# EAGLE design quadlighter (EAGLE 5.07)
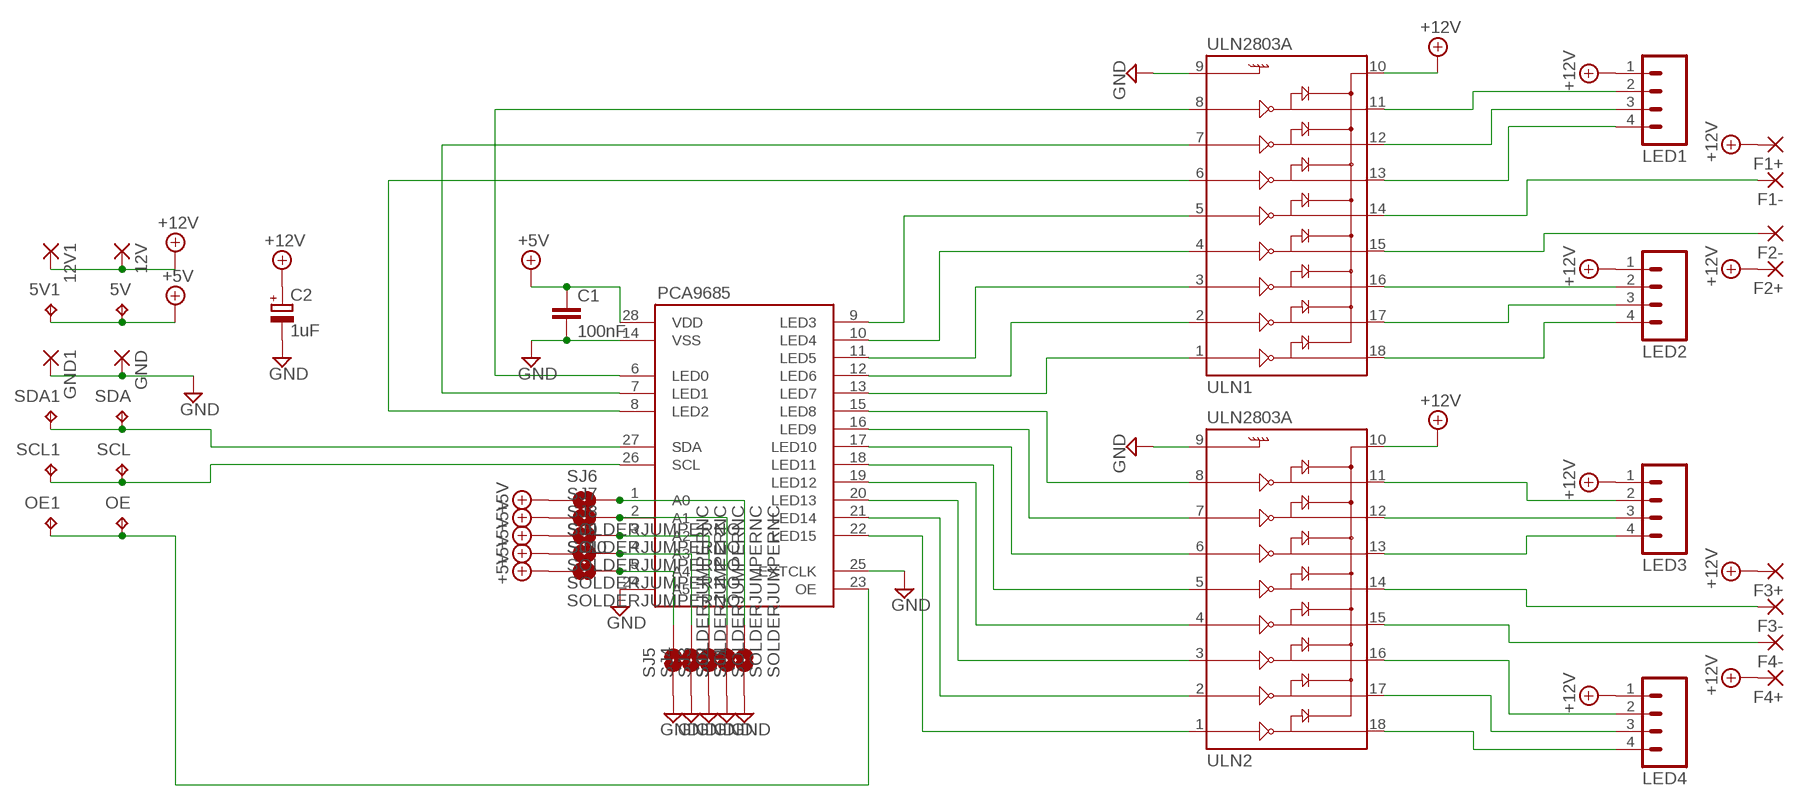
[diagram p0: schematic, sheet 1]

## Parts
5V  TPPAD1-13  [P1-13]
5V1  TPPAD1-13  [P1-13]
12V  2,54/1,1  [2,54/1,1]
12V1  2,54/1,1  [2,54/1,1]
C1  100nF  C-EUC1206  [C1206]
C2  1uF  CPOL-EUSMCB  [SMC_B]
F1+  2,54/1,1  [2,54/1,1]
F1-  2,54/1,1  [2,54/1,1]
F2+  2,54/1,1  [2,54/1,1]
F2-  2,54/1,1  [2,54/1,1]
F3+  2,54/1,1  [2,54/1,1]
F3-  2,54/1,1  [2,54/1,1]
F4+  2,54/1,1  [2,54/1,1]
F4-  2,54/1,1  [2,54/1,1]
GND  2,54/1,1  [2,54/1,1]
GND1  2,54/1,1  [2,54/1,1]
LED1  M04LONGPADS  [1X04_LONGPADS]
LED2  M04LONGPADS  [1X04_LONGPADS]
LED3  M04LONGPADS  [1X04_LONGPADS]
LED4  M04LONGPADS  [1X04_LONGPADS]
OE  TPPAD1-13  [P1-13]
OE1  TPPAD1-13  [P1-13]
PCA9685  PCA9685  [TSSOP28]
SCL  TPPAD1-13  [P1-13]
SCL1  TPPAD1-13  [P1-13]
SDA  TPPAD1-13  [P1-13]
SDA1  TPPAD1-13  [P1-13]
SJ1  SOLDERJUMPERNC  [SJ_2S]
SJ2  SOLDERJUMPERNC  [SJ_2S]
SJ3  SOLDERJUMPERNC  [SJ_2S]
SJ4  SOLDERJUMPERNC  [SJ_2S]
SJ5  SOLDERJUMPERNC  [SJ_2S]
SJ6  SOLDERJUMPERNO  [SJ_2S-NO]
SJ7  SOLDERJUMPERNO  [SJ_2S-NO]
SJ8  SOLDERJUMPERNO  [SJ_2S-NO]
SJ9  SOLDERJUMPERNO  [SJ_2S-NO]
SJ10  SOLDERJUMPERNO  [SJ_2S-NO]
ULN1  ULN2803A  ULN2803SOIC  [SO018]
ULN2  ULN2803A  ULN2803SOIC  [SO018]

## Nets
+5V: 5V1.TP 5V.TP C1.1 PCA9685.28(VDD) SJ6.1 SJ7.1 SJ8.1 SJ9.1 SJ10.1
+12V: 12V1.1(P) 12V.1(P) C2.+ F1+.1(P) F2+.1(P) F3+.1(P) F4+.1(P) LED1.1 LED2.1 LED3.1 LED4.1 ULN1.10 ULN2.10
GND: C1.2 C2.- GND1.1(P) GND.1(P) PCA9685.14(VSS) PCA9685.24(A5) PCA9685.25(EXTCLK) SJ1.1 SJ2.1 SJ3.1 SJ4.1 SJ5.1 ULN1.9 ULN2.9
N$1: PCA9685.6(LED0) ULN1.8
N$2: PCA9685.7(LED1) ULN1.7
N$3: PCA9685.8(LED2) ULN1.6
N$4: PCA9685.9(LED3) ULN1.5
N$5: PCA9685.10(LED4) ULN1.4
N$6: PCA9685.11(LED5) ULN1.3
N$7: PCA9685.12(LED6) ULN1.2
N$8: PCA9685.13(LED7) ULN1.1
N$9: PCA9685.27(SDA) SDA1.TP SDA.TP
N$10: PCA9685.26(SCL) SCL1.TP SCL.TP
N$11: OE1.TP OE.TP PCA9685.23(OE)
N$12: PCA9685.15(LED8) ULN2.8
N$13: PCA9685.16(LED9) ULN2.7
N$14: PCA9685.17(LED10) ULN2.6
N$15: PCA9685.18(LED11) ULN2.5
N$16: PCA9685.19(LED12) ULN2.4
N$17: PCA9685.20(LED13) ULN2.3
N$18: PCA9685.21(LED14) ULN2.2
N$19: PCA9685.22(LED15) ULN2.1
N$20: LED1.2 ULN1.11
N$21: F2-.1(P) ULN1.15
N$22: LED1.3 ULN1.12
N$23: LED1.4 ULN1.13
N$24: F1-.1(P) ULN1.14
N$25: PCA9685.1(A0) SJ1.2 SJ6.2
N$26: PCA9685.2(A1) SJ2.2 SJ7.2
N$27: PCA9685.3(A2) SJ3.2 SJ8.2
N$28: PCA9685.4(A3) SJ4.2 SJ9.2
N$29: PCA9685.5(A4) SJ5.2 SJ10.2
N$30: LED2.2 ULN1.16
N$31: LED3.3 ULN2.12
N$32: LED2.3 ULN1.17
N$33: LED3.2 ULN2.11
N$34: LED2.4 ULN1.18
N$35: LED3.4 ULN2.13
N$36: F3-.1(P) ULN2.14
N$37: LED4.2 ULN2.16
N$38: LED4.3 ULN2.17
N$39: LED4.4 ULN2.18
N$40: F4-.1(P) ULN2.15

## Library data of the parts
5V 5V1 OE OE1 SCL SCL1 SDA SDA1 = testpad:TP: Test pad
12V 12V1 F1+ F1- F2+ F2- F3+ F3- F4+ F4- GND GND1 = wirepad:2,54/1,1: THROUGH-HOLE PAD
C1 = rcl:C-EU: CAPACITOR, European symbol
C2 = rcl:CPOL-EU: POLARIZED CAPACITOR, European symbol
LED1-LED4 = SparkFun:M04: Header 4 Standard 4-pin 0.1" header. Use with straight break away headers (SKU : PRT-00116), right angle break away headers (PRT-00553), swiss pins (PRT-00743), machine pins (PRT-00117), and female headers (PRT-00115). Molex polarized connector foot print use with SKU : PRT-08231 with associated crimp pins and housings. 1MM SMD Version SKU: PRT-10208
PCA9685 = mylib:PCA9685
SJ1-SJ10 = SparkFun:SOLDERJUMPER: Solder Jumper Standard SMD solder jumper. Used to automate production. Two varients : Normally Open and Normally Closed are the same, but have different paste layers. NC will have a large amount of paste and should jumper during reflow.
ULN1 ULN2 = SparkFun:ULN2803: Darlington Driver ULN2803 Darlington array. 500mA max per channel, 8-channel package. Spark Fun Electronics SKU : COM-00312

## Board
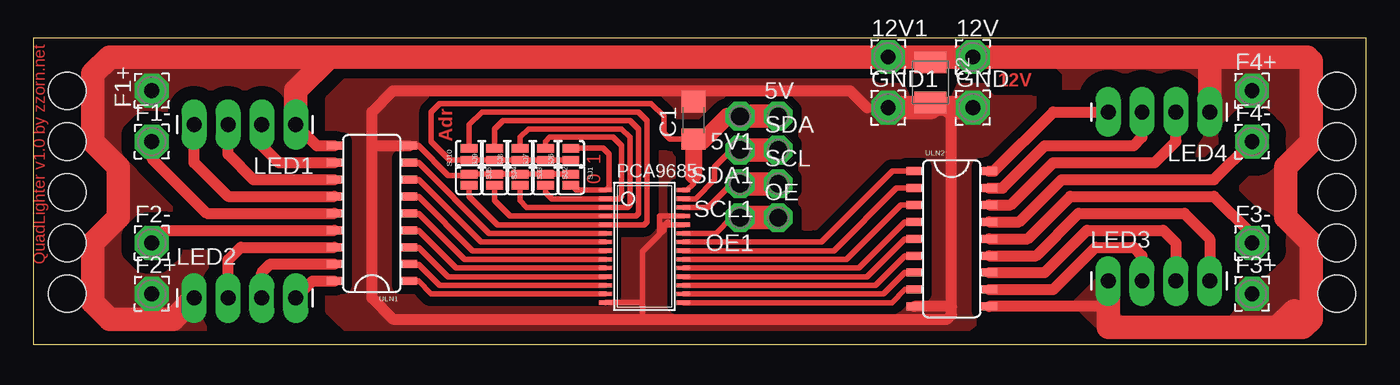
[diagram p1: board, top side]

Size 100 x 23 mm. Coordinates in mm from the lower left corner, seen from the top.
Outline: 0,0 100,0 100,23 0,23 0,0
Copper layers (1*16): Top 0.035mm / dielectric 1.5mm / Bottom 0.035mm
Design rules "default": minimum track width 10mil, minimum drill 24mil, track to track 8mil, track to pad 8mil, pad to pad 8mil, via to via 8mil, smd to smd 8mil, copper to edge 40mil, drill to drill 8mil, minimum pad ring 10mil, minimum via ring 8mil, stop-mask expansion 4mil, vias tented up to drill 0mil, thermal gap 10mil
Holes 2.8 mm at 2.54,3.81 2.54,7.62 2.54,15.24 2.54,19.05 97.79,3.81 97.79,19.05 97.79,15.24 97.79,7.62 2.54,11.43 97.79,11.43
tRestrict: area 2.5,8.3 to 4.4,14.6; area 95.9,8.3 to 97.8,14.6; 4 lines

### Footprints (pad centres in the part's own frame; a part is rotated, then mirrored left to right if it is on the bottom)
P1-13 = drill 1.321 pad 2.159 octagon: TP 0,0
2,54/1,1 = drill 1.118 pad 2.54 octagon: 1 0,0
C1206 = smd 1.6 x 1.8: 1 -1.4,0; 2 1.4,0
SMC_B = smd 1.6 x 2.4: + -1.5,0; - 1.5,0
1X04_LONGPADS = drill 1.118 pad 1.88 long: 1 0,0; 2 2.54,0; 3 5.08,0; 4 7.62,0
TSSOP28 = smd 0.305 x 0.991: 1 -4.225,-2.918; 2 -3.575,-2.918; 3 -2.925,-2.918; 4 -2.275,-2.918; 5 -1.625,-2.918; 6 -0.975,-2.918; 7 -0.325,-2.918; 8 0.325,-2.918; 9 0.975,-2.918; 10 1.625,-2.918; 11 2.275,-2.918; 12 2.925,-2.918; 13 3.575,-2.918; 14 4.225,-2.918; 15 4.225,2.918; 16 3.575,2.918; 17 2.925,2.918; 18 2.275,2.918; 19 1.625,2.918; 20 0.975,2.918; 21 0.325,2.918; 22 -0.325,2.918; 23 -0.975,2.918; 24 -1.625,2.918; 25 -2.275,2.918; 26 -2.925,2.918; 27 -3.575,2.918; 28 -4.225,2.918
SJ_2S = smd 0.635 x 1.27: 1 -0.412,0; 2 0.412,0
SJ_2S-NO = smd 0.635 x 1.27: 1 -0.45,0; 2 0.45,0
SO018 = smd 0.6 x 1.2: 1 -5.08,-2.8; 2 -3.81,-2.8; 3 -2.54,-2.8; 4 -1.27,-2.8; 5 0,-2.8; 6 1.27,-2.8; 7 2.54,-2.8; 8 3.81,-2.8; 9 5.08,-2.8; 10 5.08,2.8; 11 3.81,2.8; 12 2.54,2.8; 13 1.27,2.8; 14 0,2.8; 15 -1.27,2.8; 16 -2.54,2.8; 17 -3.81,2.8; 18 -5.08,2.8

### Placement (x,y rotation side)
5V  55.88,17.14 0 top
5V1  53.02,17.14 180 top
12V  70.48,21.59 0 top
12V1  64.14,21.59 0 top
C1  49.53,16.83 90 top
C2  67.31,19.68 270 top
F1+  8.89,19.05 90 top
F1-  8.89,15.24 0 top
F2+  8.89,3.81 0 top
F2-  8.89,7.62 0 top
F3+  91.44,3.81 0 top
F3-  91.44,7.62 0 top
F4+  91.44,19.05 0 top
F4-  91.44,15.24 0 top
GND  70.48,17.78 0 top
GND1  64.14,17.78 0 top
LED1  19.68,16.51 180 top
LED2  12.06,3.49 0 top
LED3  80.64,4.76 0 top
LED4  88.27,17.46 180 top
OE  55.88,9.53 0 top
OE1  53.02,9.53 180 top
PCA9685  45.85,7.37 270 top
SCL  55.88,12.06 0 top
SCL1  53.02,12.06 180 top
SDA  55.88,14.61 0 top
SDA1  53.02,14.61 180 top
SJ1  40.32,12.38 270 top
SJ2  38.42,12.38 270 top
SJ3  36.51,12.38 270 top
SJ4  34.61,12.38 270 top
SJ5  32.7,12.38 270 top
SJ6  40.32,14.29 90 top
SJ7  38.42,14.29 90 top
SJ8  36.51,14.29 90 top
SJ9  34.61,14.29 90 top
SJ10  32.7,14.29 90 top
ULN1  25.4,9.84 90 top
ULN2  68.9,7.94 270 top

### Tracks (layer width: path | path; a pad name or v marks a point on that pad's centre or on a via)
+5V
  Top 0.406: PCA9685.28 49.06,11.59 49.53,12.06 49.53,12.7 | 49.53,15.3 C1.1 47.76,15.43 47.31,15.88 47.31,17.14 46.35,18.1 30.48,18.1 29.84,17.46 29.84,15.24 31.25,13.84 SJ10.1 SJ9.1 SJ8.1 SJ7.1 SJ6.1
  Top 1.27: 5V1.TP 52.07,17.14 50.23,15.3 49.53,15.3 49.53,12.7
  Top 1.778: 5V1.TP 5V.TP
+12V
  Top 0.813: ULN1.10 21.27,14.92 LED1.1 | ULN2.10 80.33,2.86 80.64,2.54
  Top 1.27: 67.31,21.59 C2.+
  Top 1.778: 8.29,21.59 22.23,21.59 | 22.23,21.59 19.68,19.05 LED1.1 | 88.27,21.59 95.57,21.59 95.89,21.27 95.89,15.24 93.98,13.34 93.98,9.53 95.89,7.62 95.89,1.91 95.25,1.27 93.34,1.27 | 88.27,21.59 LED4.1 | LED3.1 80.64,2.54 80.64,1.27 93.34,1.27 | 93.34,1.27 94.61,2.54 | LED2.1 10.48,1.91 5.71,1.91 4.45,3.17 4.45,7.62 6.35,9.53 6.35,13.34 4.45,15.24 4.45,20.32 5.71,21.59 8.26,21.59 | 22.23,21.59 12V1.1 67.31,21.59 12V.1 88.27,21.59
  pour Top (isolate 1.016, no thermals): 20.32,22.86 8.26,22.86 2.54,17.78 2.54,5.08 7.62,0 20.32,0
  pour Top (isolate 1.27, no thermals): 76.2,22.86 95.25,22.86 100.33,17.78 100.33,5.08 95.25,0 81.28,0 77.47,3.81 77.47,20.32 76.2,21.59
GND
  Top 0.406: SJ1.1 SJ2.1 SJ3.1 SJ4.1 SJ5.1 32.61,12.7 31.11,12.7 28.89,14.92 ULN1.9 | PCA9685.14 42.96,3.17 45.72,3.17 | 45.72,1.91 45.72,3.17 | 47.62,9.21 47.31,8.89 47.31,8.57 46.99,8.26 | 46.99,8.26 45.72,6.99 45.72,3.17 | PCA9685.25 46.99,9.64 46.99,8.99 | 46.99,8.99 PCA9685.24 | 46.99,8.26 46.99,8.99
  Top 0.813: 62.55,17.78 61.28,19.05 50.16,19.05 | 50.16,19.05 26.99,19.05 25.4,17.46 25.4,14.92 | 25.4,14.92 25.4,3.49 26.99,1.91 45.72,1.91 68.58,1.91 68.9,2.22 68.9,2.86 | 68.9,2.86 ULN2.9 | 25.4,14.92 ULN1.9 | C1.2 50.04,18.92 50.16,19.05 | 68.9,2.86 68.9,17.78
  Top 1.27: C2.- 67.31,17.78 68.9,17.78
  Top 1.778: 67.31,17.78 GND1.1 | 68.9,17.78 GND.1
  pour Top (isolate 0.698, rank 3, no thermals): 22.23,2.54 22.23,18.41 26.04,22.23 72.07,22.23 74.93,19.37 74.93,5.08 69.22,0.64 24.13,0.64
  pour Top (no thermals): 57.78,18.73 61.59,18.73 64.77,14.61 58.42,8.57 57.78,8.57
  pour Top (no thermals): 71.44,19.37 72.07,18.73 74.93,18.73 75.25,18.41 75.25,17.78 72.39,14.92 69.53,14.92 69.22,15.24 69.22,19.37
N$1
  Top 0.406: PCA9685.6 34.2,8.34 28.89,13.65 ULN1.8
N$2
  Top 0.406: PCA9685.7 33.58,7.69 28.89,12.38 ULN1.7
N$3
  Top 0.406: PCA9685.8 32.96,7.04 28.89,11.11 ULN1.6
N$4
  Top 0.406: PCA9685.9 32.34,6.39 28.89,9.84 ULN1.5
N$5
  Top 0.406: PCA9685.10 31.72,5.74 28.89,8.57 ULN1.4
N$6
  Top 0.406: PCA9685.11 31.1,5.09 28.89,7.3 ULN1.3
N$7
  Top 0.406: PCA9685.12 30.48,4.45 28.9,6.03 ULN1.2
N$8
  Top 0.406: PCA9685.13 29.83,3.79 28.89,4.76 ULN1.1
N$9
  Top 0.406: PCA9685.27 49.68,10.94 51.12,12.38 51.12,13.34 52.39,14.61 53.02,14.29 SDA1.TP
  Top 1.778: SDA1.TP SDA.TP
N$10
  Top 0.406: PCA9685.26 50.61,10.29 52.39,12.06 SCL1.TP
  Top 1.778: SCL1.TP SCL.TP
N$11
  Top 0.406: PCA9685.23 51.2,8.34 52.39,9.53 OE1.TP
  Top 1.778: OE1.TP OE.TP
N$12
  Top 0.406: PCA9685.15 64.42,3.14 65.41,4.13 ULN2.8
N$13
  Top 0.406: PCA9685.16 63.8,3.79 65.41,5.4 ULN2.7
N$14
  Top 0.406: PCA9685.17 63.18,4.44 65.41,6.67 ULN2.6
N$15
  Top 0.406: PCA9685.18 62.56,5.09 65.41,7.94 ULN2.5
N$16
  Top 0.406: PCA9685.19 61.94,5.74 65.41,9.21 ULN2.4
N$17
  Top 0.406: PCA9685.20 61,6.39 65.09,10.48 ULN2.3
N$18
  Top 0.406: PCA9685.21 60.06,7.04 64.77,11.75 ULN2.2
N$19
  Top 0.406: PCA9685.22 59.13,7.69 64.45,13.02 ULN2.1
N$20
  Top 0.813: ULN1.11 18.41,13.65 17.14,14.92 LED1.2
N$21
  Top 0.813: ULN1.15 9.84,8.57 F2-.1
N$22
  Top 0.813: ULN1.12 16.51,12.38 14.61,14.29 LED1.3
N$23
  Top 0.813: ULN1.13 14.61,11.11 12.06,13.65 LED1.4
N$24
  Top 0.813: ULN1.14 13.02,9.84 8.89,13.97 F1-.1
N$25
  Top 0.406: SJ1.2 40.7,11.59 PCA9685.1 43.18,11.84 43.18,14.29 42.73,14.74 SJ6.2
N$26
  Top 0.406: SJ2.2 38.42,11.43 38.91,10.94 PCA9685.2 43.96,10.94 44.13,11.11 44.13,14.92 43.5,15.56 38.73,15.56 38.42,15.24 SJ7.2
N$27
  Top 0.406: SJ3.2 36.51,10.79 37.02,10.29 PCA9685.3 44.58,10.29 44.77,10.48 44.77,15.56 44.13,16.19 37.15,16.19 36.51,15.56 SJ8.2
N$28
  Top 0.406: SJ4.2 34.61,10.79 35.76,9.64 PCA9685.4 45.2,9.64 45.4,9.84 45.4,16.19 44.77,16.83 35.24,16.83 34.61,16.19 SJ9.2
N$29
  Top 0.406: SJ5.2 32.7,11.11 34.82,8.99 PCA9685.5 45.82,8.99 46.04,9.21 46.04,16.83 45.4,17.46 33.66,17.46 32.7,16.51 SJ10.2
N$30
  Top 0.813: ULN1.16 15.56,7.3 14.61,6.35 LED2.2
N$31
  Top 0.813: ULN2.12 75.88,5.4 79.06,8.57 84.77,8.57 85.72,7.62 LED3.3
N$32
  Top 0.813: ULN1.17 17.78,6.03 17.14,5.4 LED2.3
N$33
  Top 0.813: ULN2.11 76.52,4.13 79.69,7.3 82.55,7.3 83.19,6.67 LED3.2
N$34
  Top 0.813: ULN1.18 20.95,4.76 LED2.4
N$35
  Top 0.813: ULN2.13 75.25,6.67 78.42,9.84 86.36,9.84 88.27,7.94 LED3.4
N$36
  Top 0.813: ULN2.14 74.61,7.94 77.79,11.11 88.58,11.11 91.44,8.26 F3-.1
N$37
  Top 0.813: ULN2.16 73.34,10.48 76.52,13.65 84.14,13.65 85.72,15.24 LED4.2
N$38
  Top 0.813: ULN2.17 72.71,11.75 75.88,14.92 82.55,14.92 83.19,15.56 LED4.3
N$39
  Top 0.813: ULN2.18 72.07,13.02 76.52,17.46 LED4.4
N$40
  Top 0.813: ULN2.15 73.98,9.21 77.15,12.38 88.58,12.38 F4-.1
N$41  (via drill 0.6)
  other vias: 2.54,3.81
N$42  (via drill 0.6)
  other vias: 2.54,7.62
N$43  (via drill 0.6)
  other vias: 2.54,15.24
N$44  (via drill 0.6)
  other vias: 2.54,19.05
N$45  (via drill 0.6)
  other vias: 2.54,11.43
N$46  (via drill 0.6)
  other vias: 97.79,19.05
N$47  (via drill 0.6)
  other vias: 97.79,15.24
N$48  (via drill 0.6)
  other vias: 97.79,11.43
N$49  (via drill 0.6)
  other vias: 97.79,7.62
N$50  (via drill 0.6)
  other vias: 97.79,3.81

### Text on the board
Top: QuadLighter v1.0 by zzorn.net | 12V | Adr | 1 | 0
tRestrict: 5V | GND | Data | CLK | OE